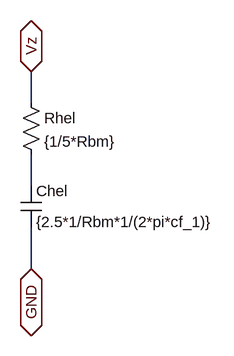
[diagram p0: schematic hel.asc]
hel.asc, the LTspice schematic file:
Version 4
SHEET 1 880 680
WIRE 128 112 128 64
WIRE 128 240 128 192
WIRE 128 368 128 304
FLAG 128 64 Vz
IOPIN 128 64 BiDir
FLAG 128 368 GND
IOPIN 128 368 BiDir
SYMBOL res 112 96 R0
SYMATTR InstName Rhel
SYMATTR Value {1/5*Rbm}
SYMBOL cap 112 240 R0
SYMATTR InstName Chel
SYMATTR Value {2.5*1/Rbm*1/(2*pi*cf_1)}

The netlist it stands for:
* hel.asc
Rhel Vz N001 {1/5*Rbm}
Chel N001 GND {2.5*1/Rbm*1/(2*pi*cf_1)}
.backanno
.end